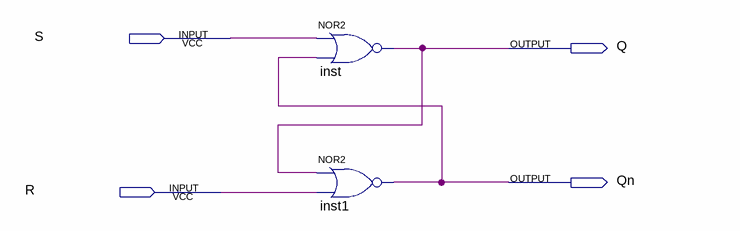
[diagram p0: schematic sheet]
// Quartus schematic LATCH_SR_NOR.bdf as structural Verilog: 2 symbols, 4 pins
module LATCH_SR_NOR (
  input  S,
  input  R,
  output Q,
  output Qn
);

  nor inst (Q, S, Qn);
  nor inst1 (Qn, Q, R);
endmodule
